# Altium schematic sheet 电源.SchDoc
size A2
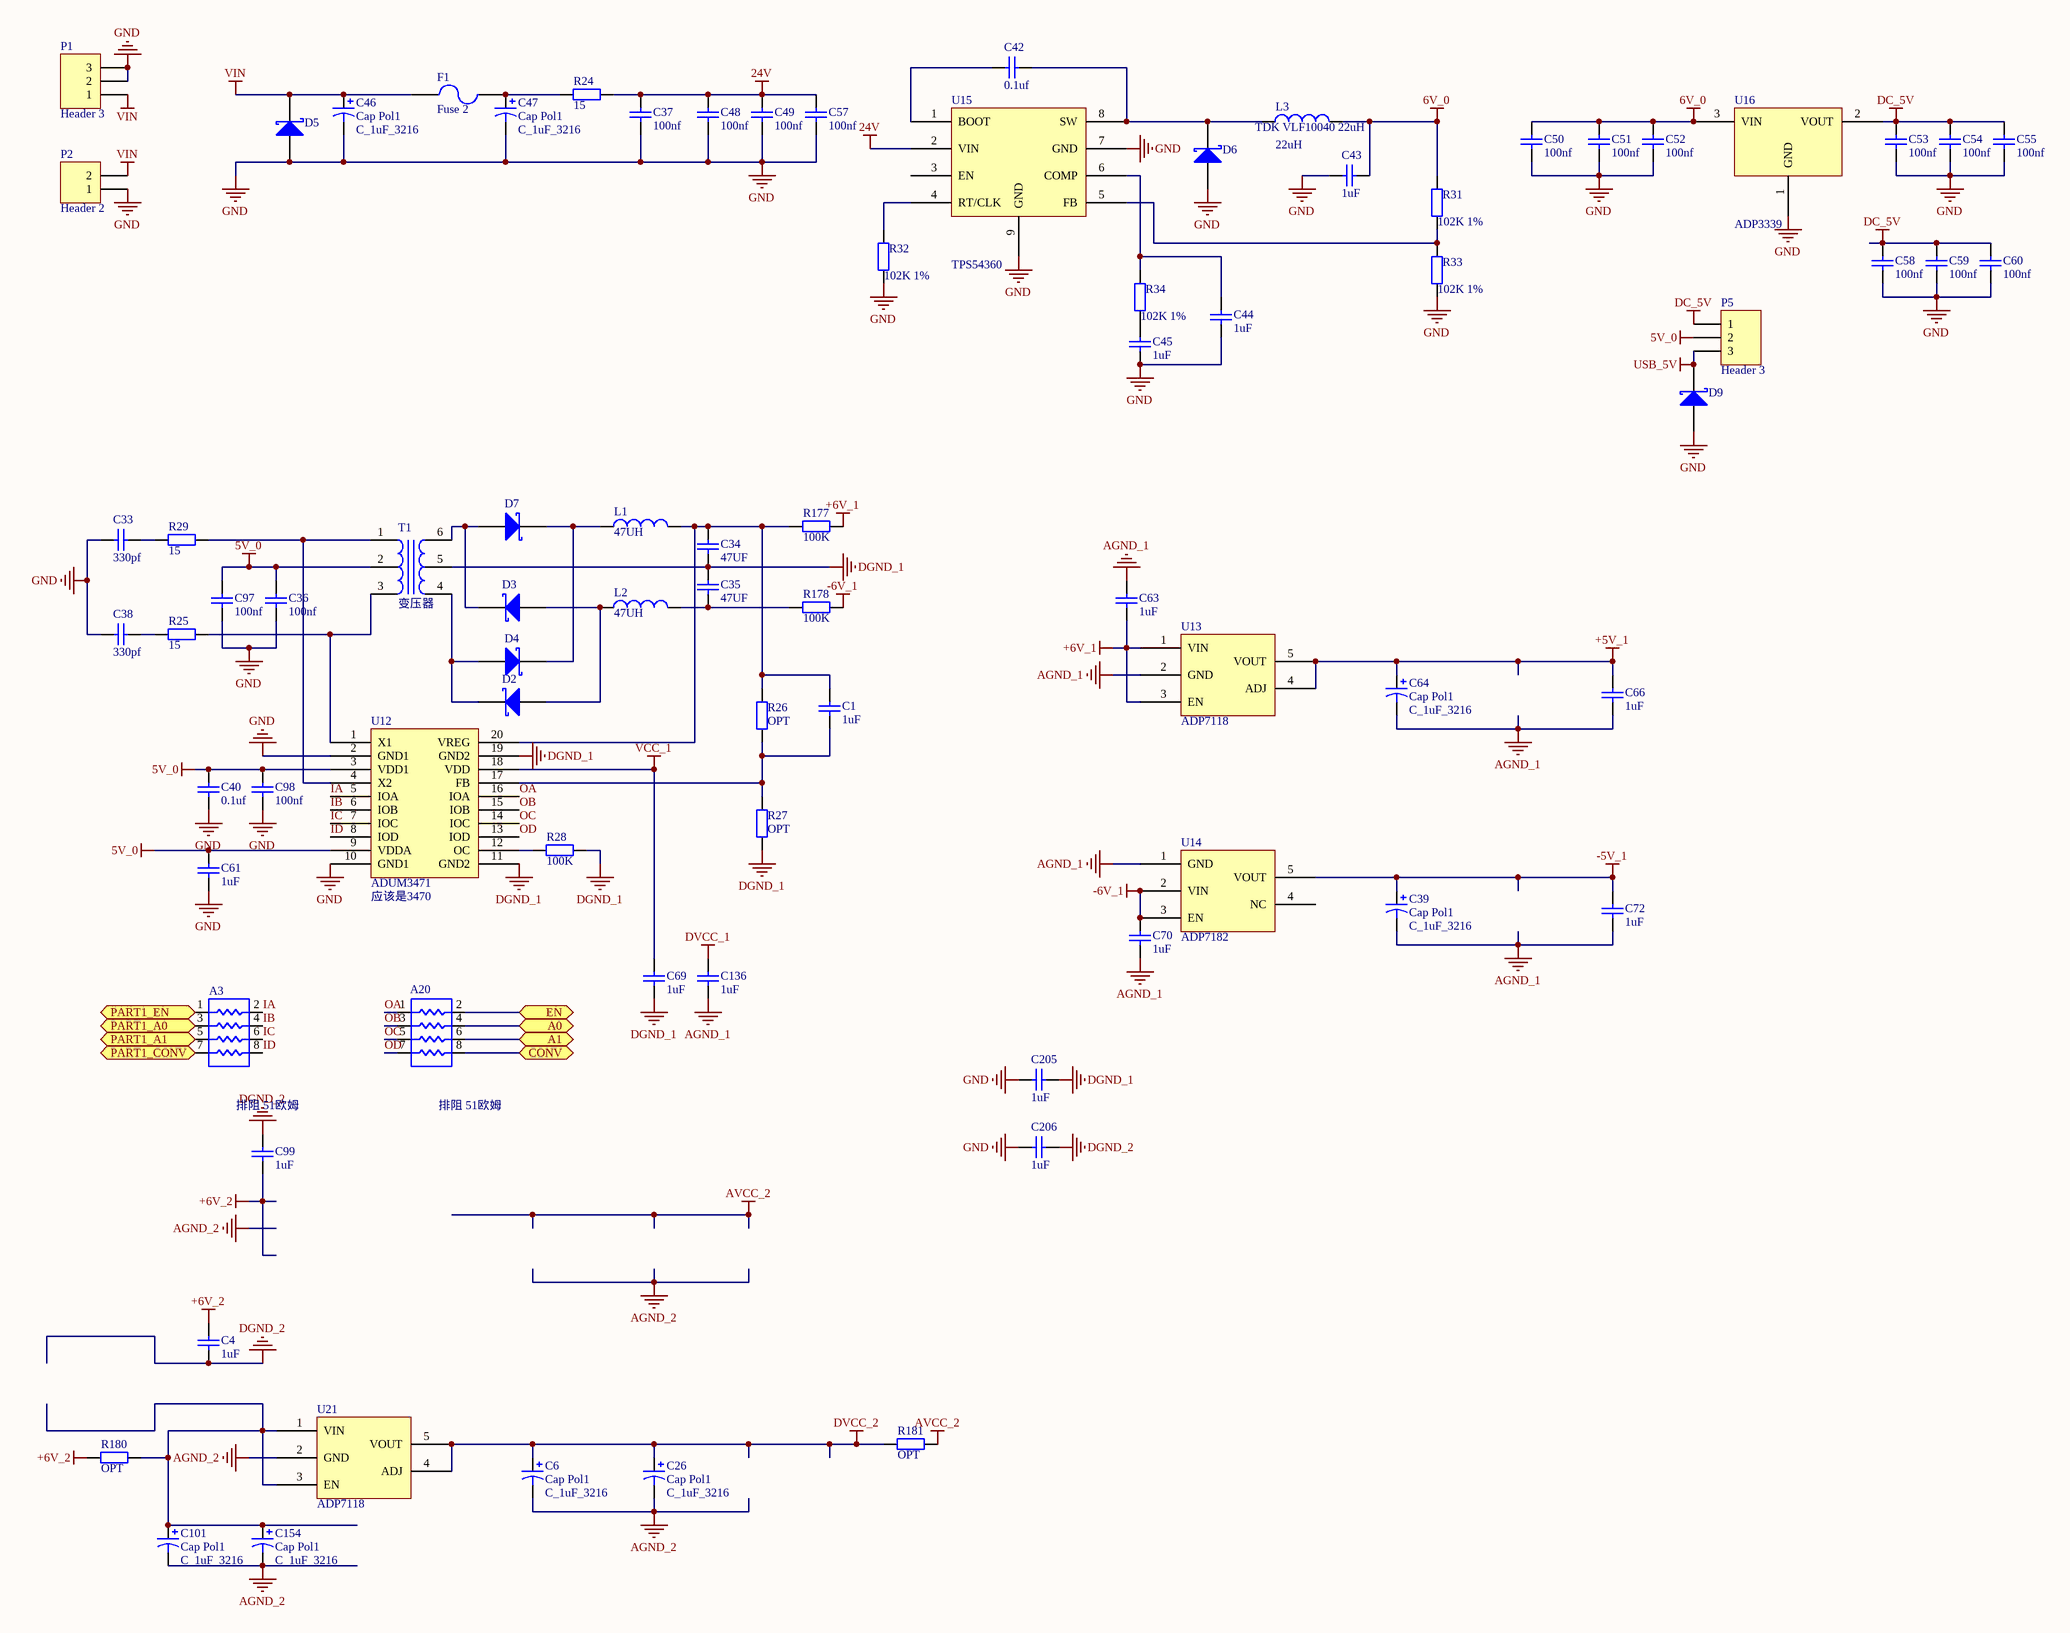
[diagram p0: 电源.SchDoc]

## Parts
A3  排阻 51欧姆  [RCA03-4D]
A20  排阻 51欧姆  [RCA03-4D]
C1  1uF  [0805C]
C4  1uF  [0805C]
C6  Cap Pol1  value C_1uF_3216  [3216]
C26  Cap Pol1  value C_1uF_3216  [3216]
C33  value 330pf  [0805C]  (hidden comment: Cap)
C34  value 47UF  [1812-C]  (hidden comment: Cap)
C35  value 47UF  [1812-C]  (hidden comment: Cap)
C36  value 100nf  [0805C]  (hidden comment: Cap)
C37  value 100nf  [1812-C]  (hidden comment: Cap)
C38  value 330pf  [0805C]  (hidden comment: Cap)
C39  Cap Pol1  value C_1uF_3216  [3216]
C40  value 0.1uf  [0805C]  (hidden comment: Cap)
C42  value 0.1uf  [独石电容]  (hidden comment: Cap)
C43  1uF  [SMD-EC-F8]
C44  1uF  [0805C]
C45  1uF  [0805C]
C46  Cap Pol1  value C_1uF_3216  [SMD-EC-F12.5]
C47  Cap Pol1  value C_1uF_3216  [0805C]
C48  value 100nf  [0805C]  (hidden comment: Cap)
C49  value 100nf  [0805C]  (hidden comment: Cap)
C50  value 100nf  [1812-C]  (hidden comment: Cap)
C51  value 100nf  [0805C]  (hidden comment: Cap)
C52  value 100nf  [0805C]  (hidden comment: Cap)
C53  value 100nf  [1812-C]  (hidden comment: Cap)
C54  value 100nf  [0805C]  (hidden comment: Cap)
C55  value 100nf  [0805C]  (hidden comment: Cap)
C57  value 100nf  [1812-C]  (hidden comment: Cap)
C58  value 100nf  [0805C]  (hidden comment: Cap)
C59  value 100nf  [0805C]  (hidden comment: Cap)
C60  value 100nf  [0805C]  (hidden comment: Cap)
C61  1uF  [0805C]
C63  1uF  [0805C]
C64  Cap Pol1  value C_1uF_3216  [3216]
C66  1uF  [0805C]
C69  1uF  [0805C]
C70  1uF  [0805C]
C72  1uF  [0805C]
C97  value 100nf  [0805C]  (hidden comment: Cap)
C98  value 100nf  [0805C]  (hidden comment: Cap)
C99  1uF  [0805C]
C101  Cap Pol1  value C_1uF_3216  [3216]
C136  1uF  [0805C]
C154  Cap Pol1  value C_1uF_3216  [3216]
C205  1uF  [7.5mm-C]
C206  1uF  [7.5mm-C]
D2  (no value)  [FB1206]
D3  (no value)  [FB1206]
D4  (no value)  [FB1206]
D5  (no value)  [SMB1]
D6  (no value)  [SMA]
D7  (no value)  [FB1206]
D9  (no value)  [SMA]
F1  Fuse 2  [1812-PPTC]
L1  value 47UH  [1812-R]  (hidden comment: Inductor)
L2  value 47UH  [1812-R]  (hidden comment: Inductor)
L3  TDK VLF10040 22uH  value 22uH  [RH74]
P1  Header 3  [DC-005A]
P2  Header 2  [2EDGK-2P]
P5  Header 3  [SIP03]
R24  value 15  [FB1206]  (hidden comment: Res2)
R25  value 15  [0805R]  (hidden comment: Res2)
R26  value OPT  [0805R]  (hidden comment: Res2)
R27  value OPT  [0805R]  (hidden comment: Res2)
R28  value 100K  [0805R]  (hidden comment: Res2)
R29  value 15  [0805R]  (hidden comment: Res2)
R31  102K 1%  [0805R]
R32  102K 1%  [0805R]
R33  102K 1%  [0805R]
R34  102K 1%  [0805R]
R177  value 100K  [0805R]  (hidden comment: Res2)
R178  value 100K  [0805R]  (hidden comment: Res2)
R180  value OPT  [0805R]  (hidden comment: Res2)
R181  value OPT  [0805R]  (hidden comment: Res2)
T1  变压器  [变压器]
U12  ADUM3471  [SSOP20]
U13  ADP7118  [SOT-23-5]
U14  ADP7182  [SOT-23-5]
U15  TPS54360  [TPS54360]
U16  ADP3339  [_SOT-223]
U21  ADP7118  [SOT-23-5]

## Ports
A0, A1, CONV, EN, PART1_A0, PART1_A1, PART1_CONV, PART1_EN

## Nets
5V_0: C36.2 C40.1 C61.1 C97.2 C98.2 P5.2 T1.2 U12.3(VDD1) U12.9(VDDA)
6V_0: C43.1 C50.2 C51.2 C52.2 L3.2 R31.2 U16.3(VIN)
24V: C37.2 C48.2 C49.2 C57.2 R24.2 U15.2(VIN)
+5V_1: C64.1 C66.1 U13.4(ADJ) U13.5(VOUT)
+6V_1: C63.2 R177.2 U13.1(VIN) U13.3(EN)
+6V_2: C4.1 C99.2 R180.1
-5V_1: C39.1 C72.1 U14.5(VOUT)
-6V_1: C70.1 R178.2 U14.2(VIN) U14.3(EN)
AGND_1: C39.2 C63.1 C64.2 C66.2 C70.2 C72.2 C136.2 U13.2(GND) U14.1(GND)
AGND_2: C6.2 C26.2 C101.2 C154.2 U21.2(GND)
AVCC_2: R181.2
DC_5V: C53.2 C54.2 C55.2 C58.2 C59.2 C60.2 P5.1 U16.2(VOUT)
DGND_1: C34.1 C35.2 C69.2 C205.2 R27.2 R28.2 T1.5 U12.11(GND2) U12.19(GND2)
DGND_2: C4.2 C99.1 C206.2
DVCC_1: C136.1
DVCC_2: C6.1 C26.1 R181.1 U21.4(ADJ) U21.5(VOUT)
GND: C33.1 C36.1 C37.1 C38.1 C40.2 C43.2 C44.2 C45.2 C46.2 C47.2 C48.1 C49.1 C50.1 C51.1 C52.1 C53.1 C54.1 C55.1 C57.1 C58.1 C59.1 C60.1 C61.2 C97.1 C98.1 C205.1 C206.1 D5.1(A) D6.1(A) D9.1(A) P1.2 P1.3 P2.1 R32.1 R33.1 U12.2(GND1) U12.10(GND1) U15.7(GND) U15.9(GND) U16.1(GND)
USB_5V: D9.2(K) P5.3
VCC_1: C69.1 U12.18(VDD)
VIN: C46.1 D5.2(K) F1.1 P1.1 P2.2
A0: A20.4 ; port A0
A1: A20.6 ; port A1
CONV: A20.8 ; port CONV
EN: A20.2 ; port EN
IA: A3.2 U12.5(IOA)
IB: A3.4 U12.6(IOB)
IC: A3.6 U12.7(IOC)
ID: A3.8 U12.8(IOD)
OA: A20.1 U12.16(IOA)
OB: A20.3 U12.15(IOB)
OC: A20.5 U12.14(IOC)
OD: A20.7 U12.13(IOD)
PART1_A0: A3.3 ; port PART1_A0
PART1_A1: A3.5 ; port PART1_A1
PART1_CONV: A3.7 ; port PART1_CONV
PART1_EN: A3.1 ; port PART1_EN
NetC1_1: C1.1 C34.2 L1.2 R26.1 R177.1 U12.20(VREG)
NetC1_2: C1.2 R26.2 R27.1 U12.17(FB)
NetC33_2: C33.2 R29.1
NetC35_1: C35.1 L2.2 R178.1
NetC38_2: C38.2 R25.1
NetC42_1: C42.1 U15.1(BOOT)
NetC42_2: C42.2 D6.2(K) L3.1 U15.8(SW)
NetC44_1: C44.1 R34.2 U15.6(COMP)
NetC45_1: C45.1 R34.1
NetC47_1: C47.1 F1.2 R24.1
NetC101_1: C101.1 C154.1 R180.2 U21.1(VIN) U21.3(EN)
NetD2_1: D2.1(A) D3.1(A) L2.1
NetD2_2: D2.2(K) D4.1(A) T1.4
NetD3_2: D3.2(K) D7.1(A) T1.6
NetD4_2: D4.2(K) D7.2(K) L1.1
NetR25_2: R25.2 T1.3 U12.1(X1)
NetR28_1: R28.1 U12.12(OC)
NetR29_2: R29.2 T1.1 U12.4(X2)
NetR31_1: R31.1 R33.2 U15.5(FB)
NetR32_2: R32.2 U15.4(RT/CLK)

Not connected (* = marked no-connect by the designer): U14 4(NC); U15 3(EN)

## Notes on the sheet
- (near U12) 应该是3470

## Library data of the parts
A3 A20 = RESPACK5
C1 C4 C33-C38 C40 C42-C45 C48-C55 C57-C61 C63 C66 C69 C70 C72 C97-C99 C136 C205 C206 = Cap: Capacitor; Published: 8-Jun-2000; LatestRevisionDate: 17-Jul-2002; LatestRevisionNote: Re-released for DXP Platform.; PackageReference: RAD-0.3; Publisher: Altium Limited; PackageDescription: Radial Cap, Thru-Hole; 2 Leads; 0.3 in Pin Spacing
  C1 C4 C43-C45 C61 C63 C66 C69 C70 C72 C99 C136 C205 C206: Value: 1uF
C6 C26 C39 C46 C47 C64 C101 C154 = Cap Pol1: Polarized Capacitor (Radial); Published: 8-Jun-2000; LatestRevisionDate: 17-Jul-2002; LatestRevisionNote: Re-released for DXP Platform.; PackageReference: RB7.6-15; Publisher: Altium Limited
D2-D7 D9 = Diode 11DQ03: Schottky Rectifier; Published: 8-Jun-2000; LatestRevisionDate: 17-Jul-2002; LatestRevisionNote: Re-released for DXP Platform.; DatasheetVersion: Dec-1997; PackageReference: DO-204AL; Publisher: Altium Limited; PackageDescription: Diode, Axial; Body 5.2 x 2.7 mm (LxDia. max), Lead Dia. 0.86 mm (max); Code_JEDEC: DO-204-AL; ComponentLink1Description: Manufacturer Link; ComponentLink1URL: http://www.irf.com/; ComponentLink2Description: Datasheet; ComponentLink2URL: http://www.irf.com/product-info/datasheets/data/11dq03.pdf
F1 = Fuse 2: Fuse; Published: 8-Jun-2000; LatestRevisionDate: 17-Jul-2002; LatestRevisionNote: Re-released for DXP Platform.; PackageReference: PIN-W2/E2.8; Publisher: Altium Limited; PackageDescription: Thru-Hole; 2 Leads
L1-L3 = Inductor: Code_IEC: 1005; Published: 8-Jun-2000; LatestRevisionDate: 29-May-2009; LatestRevisionNote: IPC-7351 Footprint Added.; PackageReference: 0402-A; Publisher: Altium Limited; PackageDescription: Chip Inductor; Code_JEITA: 0402
P1 P5 = Header 3: Header, 3-Pin; LatestRevisionDate: 17-Jul-2002; LatestRevisionNote: Re-released for DXP Platform.; Publisher: Altium Limited
P2 = Header 2: Header, 2-Pin; LatestRevisionDate: 17-Jul-2002; LatestRevisionNote: Re-released for DXP Platform.; Publisher: Altium Limited
R24-R29 R31-R34 R177 R178 R180 R181 = Res2: Resistor; Published: 8-Jun-2000; LatestRevisionDate: 17-Jul-2002; LatestRevisionNote: Re-released for DXP Platform.; PackageReference: AXIAL-0.4; Publisher: Altium Limited; PackageDescription: Axial Device, Thru-Hole; 2 Leads; 0.4 in Pin Spacing
  R31-R34: Value: 102K